# EAGLE design TrakerSłonecznyV3 (EAGLE 9.6.2)
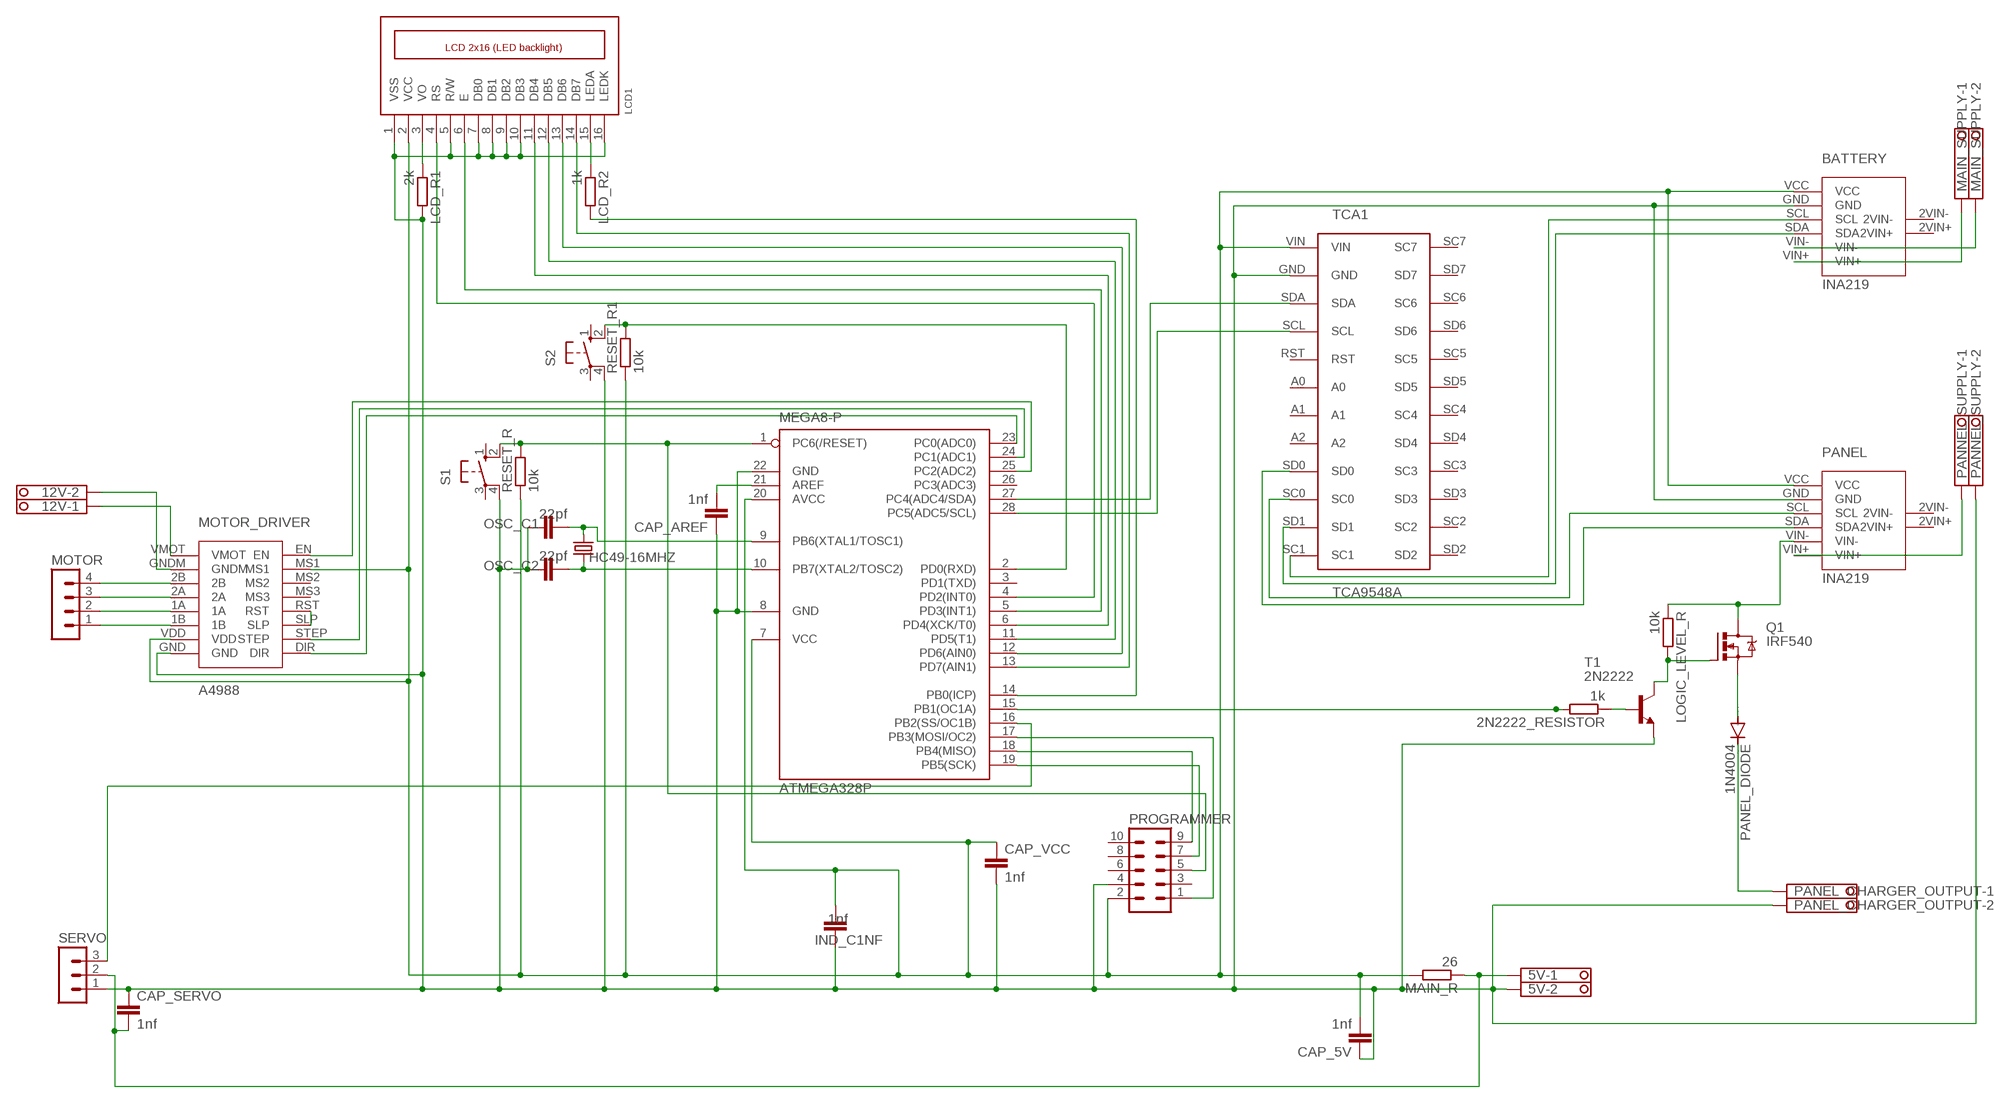
[diagram p0: schematic, sheet 1]

## Parts
2N2222_RESISTOR  1k  R-EU_0207/2V  [0207/2V]
5V  TERMINAL-BLOCK-3.5MM-2-PIN-ROUND-PAD  [TERMINAL-BLOCK-2-PIN-3.5MM-ROUND-PAD]
12V  TERMINAL-BLOCK-3.5MM-2-PIN-ROUND-PAD  [TERMINAL-BLOCK-2-PIN-3.5MM-ROUND-PAD]
ATMEGA328P  MEGA8-P  [DIL28-3]
BATTERY  INA219  [INA219]
CAP_5V  1nf  C-EU025-024X044  [C025-024X044]
CAP_AREF  1nf  C-EU025-024X044  [C025-024X044]
CAP_SERVO  1nf  C-EU025-024X044  [C025-024X044]
CAP_VCC  1nf  C-EU025-024X044  [C025-024X044]
HC49-16MHZ  CRYTALHC49S  [HC49/S]
IND_C1NF  1nf  C-EU025-024X044  [C025-024X044]
LCD1  LCD_2X16_SIL  [HY-1602F]
LCD_R1  2k  R-EU_0207/2V  [0207/2V]
LCD_R2  1k  R-EU_0207/2V  [0207/2V]
LOGIC_LEVEL_R  10k  R-EU_0207/2V  [0207/2V]
MAIN_R  26  R-EU_0207/2V  [0207/2V]
MAIN_SUPPLY  TERMINAL-BLOCK-3.5MM-2-PIN-ROUND-PAD  [TERMINAL-BLOCK-2-PIN-3.5MM-ROUND-PAD]
MOTOR  MA04-1  [MA04-1]
MOTOR_DRIVER  A4988  [A4988]
OSC_C1  22pf  C-EU025-024X044  [C025-024X044]
OSC_C2  22pf  C-EU025-024X044  [C025-024X044]
PANEL  INA219  [INA219]
PANEL_CHARGER_OUTPUT  TERMINAL-BLOCK-3.5MM-2-PIN-ROUND-PAD  [TERMINAL-BLOCK-2-PIN-3.5MM-ROUND-PAD]
PANEL_DIODE  1N4004  [DO41-10]
PANNEL_SUPPLY  TERMINAL-BLOCK-3.5MM-2-PIN-ROUND-PAD  [TERMINAL-BLOCK-2-PIN-3.5MM-ROUND-PAD]
PROGRAMMER  MA05-2  [MA05-2]
Q1  IRF540  [TO220BV]
RESET_R  10k  R-EU_0207/2V  [0207/2V]
RESET_R1  10k  R-EU_0207/2V  [0207/2V]
S1  10-XX  [B3F-10XX]
S2  10-XX  [B3F-10XX]
SERVO  MA03-1  [MA03-1]
T1  2N2222  [TO92-EBC-OVAL]
TCA1  TCA9548A  [TCA9548A]

## Nets
5V: ATMEGA328P.7(VCC) ATMEGA328P.20(AVCC) BATTERY.VCC CAP_5V.2 CAP_VCC.1 IND_C1NF.2 LCD1.2(VCC) MAIN_R.2 MOTOR_DRIVER.MS1 MOTOR_DRIVER.VDD PANEL.VCC PROGRAMMER.2 RESET_R1.1 RESET_R.1 TCA1.VIN
GND: 5V.2 ATMEGA328P.8(GND) ATMEGA328P.22(GND) BATTERY.GND CAP_5V.1 CAP_AREF.1 CAP_SERVO.1 CAP_VCC.2 IND_C1NF.1 LCD1.1(VSS) LCD1.5(R/W) LCD1.7(DB0) LCD1.8(DB1) LCD1.9(DB2) LCD1.10(DB3) LCD1.16(LEDK) LCD_R1.2 MOTOR_DRIVER.GND OSC_C1.1 OSC_C2.1 PANEL.GND PANEL_CHARGER_OUTPUT.2 PANNEL_SUPPLY.2 PROGRAMMER.4 S1.4(P1) S2.4(P1) SERVO.1 T1.E TCA1.GND
N$1: BATTERY.SCL TCA1.SC1
N$2: ATMEGA328P.9(PB6(XTAL1/TOSC1)) HC49-16MHZ.1 OSC_C1.2
N$3: ATMEGA328P.10(PB7(XTAL2/TOSC2)) HC49-16MHZ.2 OSC_C2.2
N$4: 2N2222_RESISTOR.2 ATMEGA328P.15(PB1(OC1A))
N$5: ATMEGA328P.16(PB2(SS/OC1B)) SERVO.3
N$6: 5V.1 CAP_SERVO.2 MAIN_R.1 SERVO.2
N$7: BATTERY.SDA TCA1.SD1
N$8: ATMEGA328P.6(PD4(XCK/T0)) LCD1.11(DB4)
N$9: MOTOR.1 MOTOR_DRIVER.1B
N$10: MOTOR.2 MOTOR_DRIVER.1A
N$11: ATMEGA328P.11(PD5(T1)) LCD1.12(DB5)
N$12: ATMEGA328P.12(PD6(AIN0)) LCD1.13(DB6)
N$13: ATMEGA328P.13(PD7(AIN1)) LCD1.14(DB7)
N$14: PANEL.SDA TCA1.SD0
N$15: PANEL.SCL TCA1.SC0
N$16: MOTOR.3 MOTOR_DRIVER.2A
N$17: PANEL.VIN+ PANNEL_SUPPLY.1
N$18: ATMEGA328P.4(PD2(INT0)) LCD1.4(RS)
N$19: BATTERY.VIN+ MAIN_SUPPLY.1
N$20: ATMEGA328P.27(PC4(ADC4/SDA)) TCA1.SDA
N$21: ATMEGA328P.28(PC5(ADC5/SCL)) TCA1.SCL
N$22: BATTERY.VIN- MAIN_SUPPLY.2
N$23: LOGIC_LEVEL_R.1 PANEL.VIN- Q1.D
N$24: ATMEGA328P.14(PB0(ICP)) LCD_R2.2
N$25: ATMEGA328P.21(AREF) CAP_AREF.2
N$26: ATMEGA328P.1(PC6(/RESET)) PROGRAMMER.5 RESET_R.2 S1.2(S1)
N$27: MOTOR.4 MOTOR_DRIVER.2B
N$28: LOGIC_LEVEL_R.2 Q1.G T1.C
N$29: 12V.2 MOTOR_DRIVER.GNDM
N$30: 12V.1 MOTOR_DRIVER.VMOT
N$31: MOTOR_DRIVER.RST MOTOR_DRIVER.SLP
N$32: ATMEGA328P.23(PC0(ADC0)) MOTOR_DRIVER.DIR
N$33: ATMEGA328P.24(PC1(ADC1)) MOTOR_DRIVER.STEP
N$34: ATMEGA328P.25(PC2(ADC2)) MOTOR_DRIVER.EN
N$35: 2N2222_RESISTOR.1 T1.B
N$36: ATMEGA328P.2(PD0(RXD)) RESET_R1.2 S2.2(S1)
N$38: PANEL_CHARGER_OUTPUT.1 PANEL_DIODE.C
N$39: PANEL_DIODE.A Q1.S
N$40: LCD1.15(LEDA) LCD_R2.1
N$41: ATMEGA328P.17(PB3(MOSI/OC2)) PROGRAMMER.1
N$43: ATMEGA328P.19(PB5(SCK)) PROGRAMMER.7
N$44: ATMEGA328P.18(PB4(MISO)) PROGRAMMER.9
N$45: ATMEGA328P.5(PD3(INT1)) LCD1.6(E)
N$47: LCD1.3(VO) LCD_R1.1
Unconnected: ATMEGA328P.3(PD1(TXD)) ATMEGA328P.26(PC3(ADC3)) BATTERY.2VIN+ BATTERY.2VIN- MOTOR_DRIVER.MS2 MOTOR_DRIVER.MS3 PANEL.2VIN+ PANEL.2VIN- PROGRAMMER.3 PROGRAMMER.6 PROGRAMMER.8 PROGRAMMER.10 S1.1(S) S1.3(P) S2.1(S) S2.3(P) TCA1.A0 TCA1.A1 TCA1.A2 TCA1.RST TCA1.SC2 TCA1.SC3 TCA1.SC4 TCA1.SC5 TCA1.SC6 TCA1.SC7 TCA1.SD2 TCA1.SD3 TCA1.SD4 TCA1.SD5 TCA1.SD6 TCA1.SD7

## Library data of the parts
2N2222_RESISTOR LCD_R1 LCD_R2 LOGIC_LEVEL_R MAIN_R RESET_R RESET_R1 = rcl:R-EU_: RESISTOR, European symbol; SPICEPREFIX: R
5V 12V MAIN_SUPPLY PANEL_CHARGER_OUTPUT PANNEL_SUPPLY = Rembrandt Electronics - Terminal Block 3-5mm v1-0:TERMINAL-BLOCK-3.5MM-2-PIN: Terminal Block 3.5mm Pitch: 3,5 mm Number of pins: 2 Created by Rembrandt Electronics www.rembrandtelectronics.com
ATMEGA328P = atmel:MEGA8-P: MICROCONTROLLER 8 Kbytes FLASH, 1 kbytes SRAM, 512 bytes EEPROM, USART, 4-channel 10 bit ADC, 2-channel 8 bit ADC Pin compatible with Atmega48, ATMega88, ATMega168 Source: avr.lbr; OC_FARNELL: unknown; OC_NEWARK: unknown
BATTERY PANEL = TrackerSłonecznyLIB:INA219
CAP_5V CAP_AREF CAP_SERVO CAP_VCC IND_C1NF OSC_C1 OSC_C2 = rcl:C-EU: CAPACITOR, European symbol; SPICEPREFIX: C
HC49-16MHZ = crystal:CRYTAL: CRYSTAL
LCD1 = lcd_2x16_led_backlight:LCD_2X16_SIL
MOTOR = con-lstb:MA04-1: PIN HEADER; OC_FARNELL: unknown; OC_NEWARK: unknown
MOTOR_DRIVER = TrackerSłonecznyLIB:A4988
PANEL_DIODE = diode:1N4004: DIODE general purpose rectifier, 1 A
PROGRAMMER = con-lstb:MA05-2: PIN HEADER; OC_FARNELL: unknown; OC_NEWARK: unknown
Q1 = transistor-power:IRF540: HEXFET Power MOSFET
S1 S2 = switch-omron:10-XX: OMRON SWITCH; MPN: B3F-1000; OC_FARNELL: 176432; OC_NEWARK: 36M3542
SERVO = con-lstb:MA03-1: PIN HEADER; OC_FARNELL: unknown; OC_NEWARK: unknown
T1 = adafruit:2N2222: NPN TRANSISTOR Big oval pads
TCA1 = TrackerSłonecznyLIB:TCA9548A

## Board
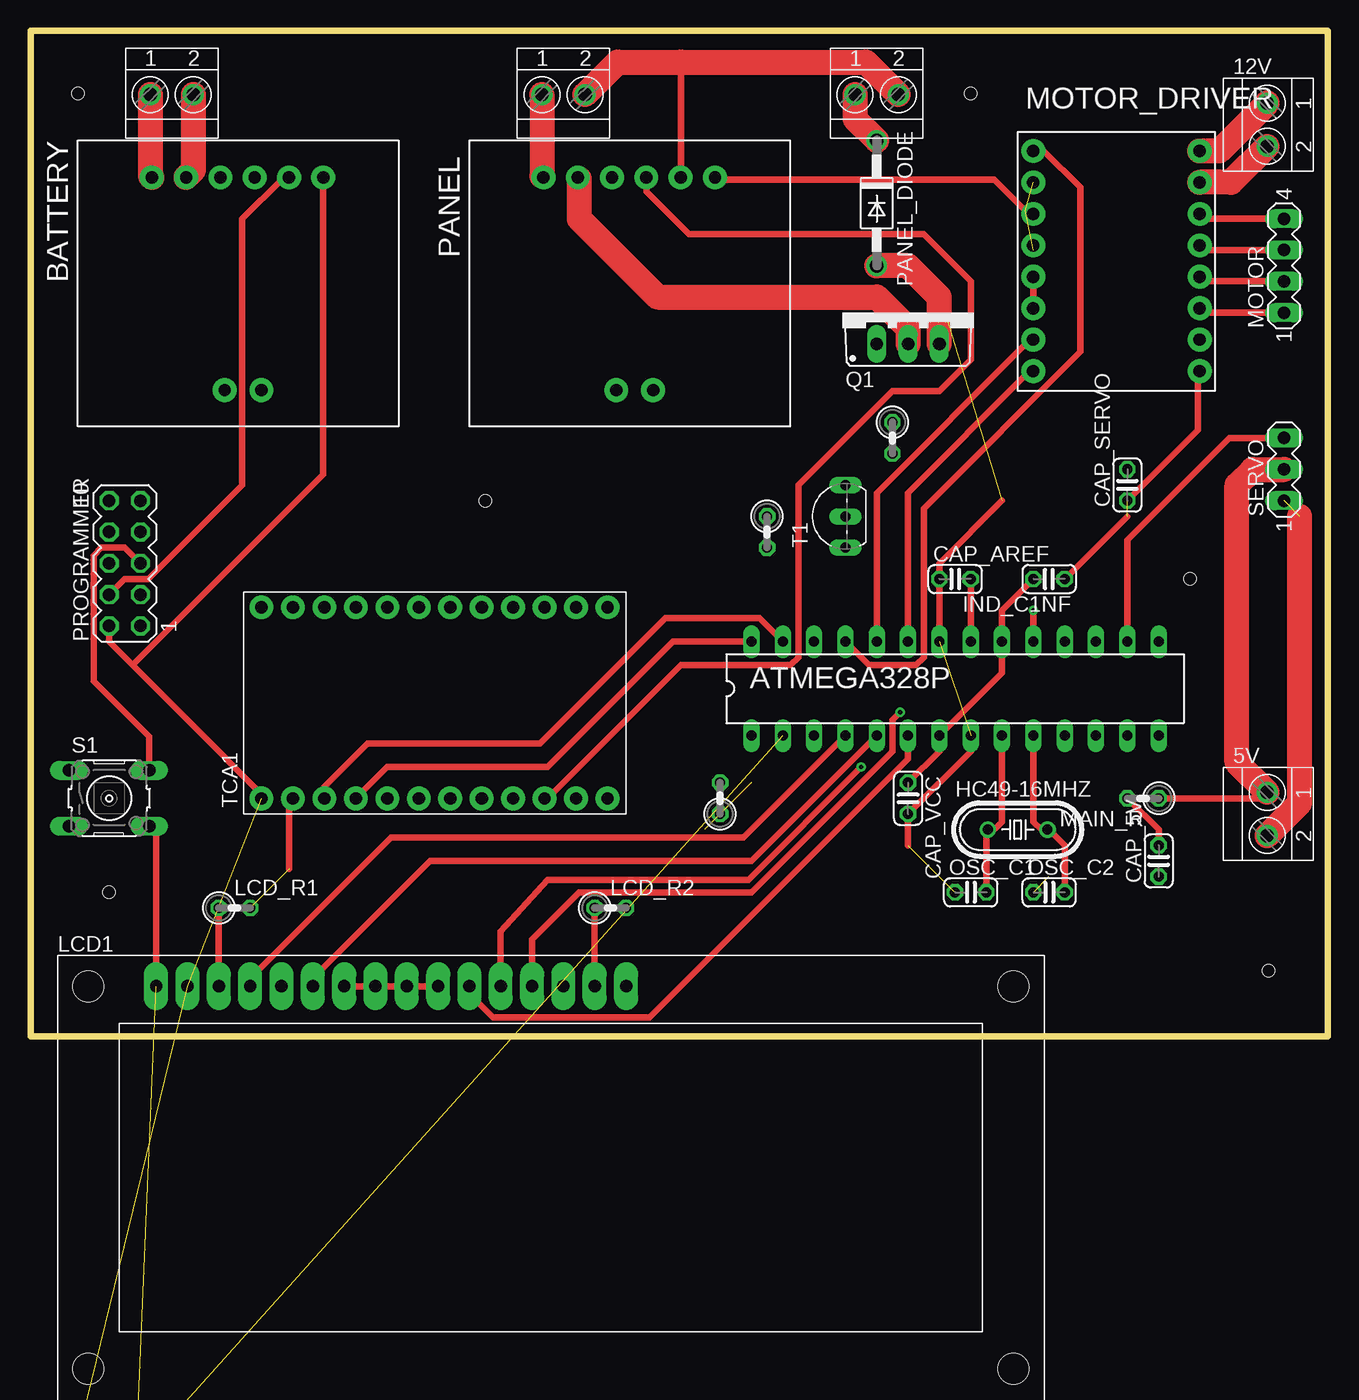
[diagram p1: board, top side]
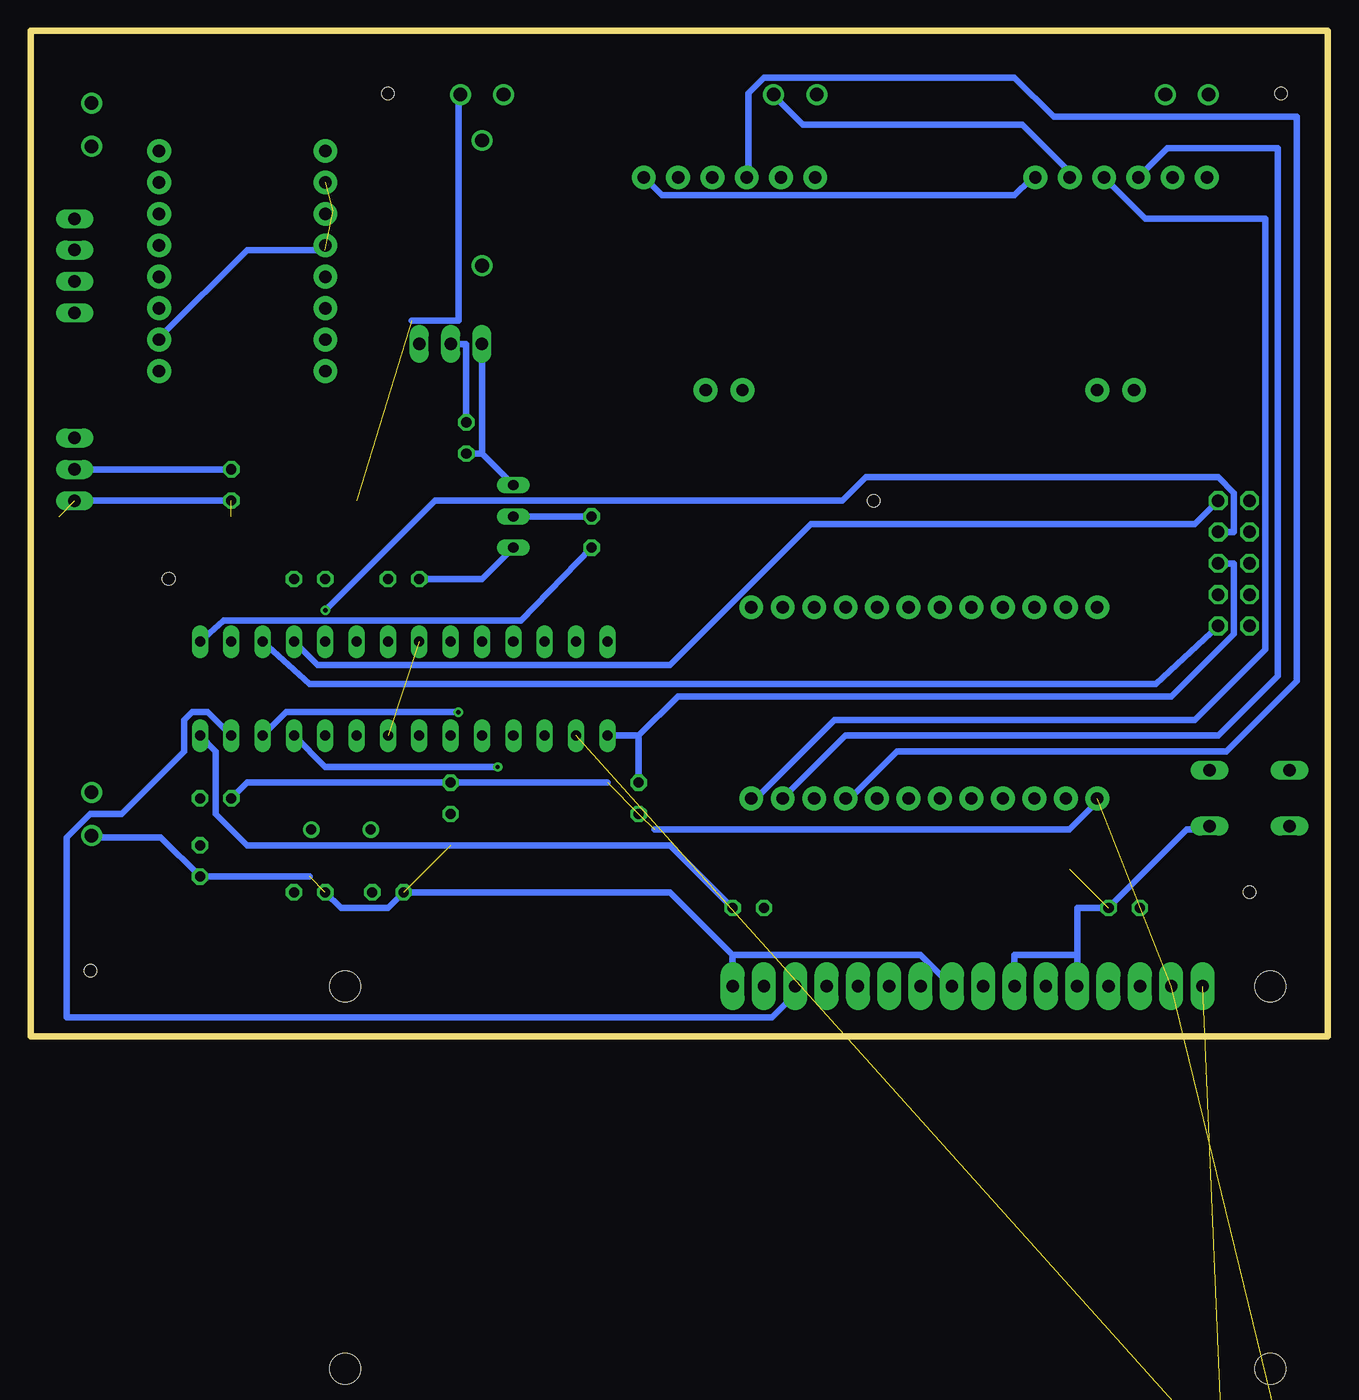
[diagram p2: board, bottom side, seen from below]

Size 105.16 x 81.52 mm. Coordinates in mm from the lower left corner, seen from the top.
Outline: 0,0 105.16,0 105.16,81.52 0,81.52 0,0
Copper layers (1*16): Top 0.035mm / dielectric 1.5mm / Bottom 0.035mm
Design rules "default": minimum track width 6mil, minimum drill 0.35mm, track to track 6mil, track to pad 6mil, pad to pad 6mil, via to via 6mil, smd to smd 6mil, copper to edge 40mil, drill to drill 6mil, minimum pad ring 10mil, minimum via ring 8mil, stop-mask expansion 4mil, vias tented up to drill 0mil, thermal gap 10mil
Holes 1 mm at 3.81,76.45 36.83,43.43 76.2,76.45 93.98,37.08 100.33,5.33 6.35,11.68

### Footprints (pad centres in the part's own frame; a part is rotated, then mirrored left to right if it is on the bottom)
0207/2V = drill 0.813 octagon: 1 -1.27,0; 2 1.27,0
TERMINAL-BLOCK-2-PIN-3.5MM-ROUND-PAD = drill 1.1 pad 1.7: 1 -1.75,-0.1; 2 1.75,-0.1
DIL28-3 = drill 0.813 long: 1 -16.51,-3.81; 2 -13.97,-3.81; 3 -11.43,-3.81; 4 -8.89,-3.81; 5 -6.35,-3.81; 6 -3.81,-3.81; 7 -1.27,-3.81; 8 1.27,-3.81; 9 3.81,-3.81; 10 6.35,-3.81; 11 8.89,-3.81; 12 11.43,-3.81; 13 13.97,-3.81; 14 16.51,-3.81; 15 16.51,3.81; 16 13.97,3.81; 17 11.43,3.81; 18 8.89,3.81; 19 6.35,3.81; 20 3.81,3.81; 21 1.27,3.81; 22 -1.27,3.81; 23 -3.81,3.81; 24 -6.35,3.81; 25 -8.89,3.81; 26 -11.43,3.81; 27 -13.97,3.81; 28 -16.51,3.81
INA219 = drill 1 pad 1.93: 2VIN+ 20.25,11.9; 2VIN- 20.25,14.89; GND 3,17.12; SCL 3,14.34; SDA 3,11.56; VCC 3,19.9; VIN+ 3,6; VIN- 3,8.78
C025-024X044 = drill 0.813 octagon: 1 -1.27,0; 2 1.27,0
HC49/S = drill 0.813: 1 -2.413,0; 2 2.413,0
HY-1602F = drill 1 pad 1.93 long: 1 2.54,0; 2 5.08,0; 3 7.62,0; 4 10.16,0; 5 12.7,0; 6 15.24,0; 7 17.78,0; 8 20.32,0; 9 22.86,0; 10 25.4,0; 11 27.94,0; 12 30.48,0; 13 33.02,0; 14 35.56,0; 15 38.1,0; 16 40.64,0 | hole 2.5: -2.96,0; 72.04,0; -2.96,-31; 72.04,-31
MA04-1 = drill 1.016 long: 1 -3.81,0; 2 -1.27,0; 3 1.27,0; 4 3.81,0
A4988 = drill 1 pad 1.93: 1A 14.75,9.26; 1B 14.75,6.71; 2A 14.75,11.81; 2B 14.75,14.36; DIR 1.26,1.61; EN 1.26,19.46; GND 14.75,1.61; GNDM 14.75,16.91; MS1 1.26,16.91; MS2 1.26,14.36; MS3 1.26,11.81; RST 1.26,9.26; SLP 1.26,6.71; STEP 1.26,4.16; VDD 14.75,4.16; VMOT 14.75,19.46
DO41-10 = drill 1.118: A 5.08,0; C -5.08,0
MA05-2 = drill 1.016 octagon: 1 -5.08,-1.27; 2 -5.08,1.27; 3 -2.54,-1.27; 4 -2.54,1.27; 5 0,-1.27; 6 0,1.27; 7 2.54,-1.27; 8 2.54,1.27; 9 5.08,-1.27; 10 5.08,1.27
TO220BV = drill 1.016 long: D 0,-2.54; G -2.54,-2.54; S 2.54,-2.54
B3F-10XX = drill 1.016 long: 1 -3.251,2.261; 2 3.251,2.261; 3 -3.251,-2.261; 4 3.251,-2.261
MA03-1 = drill 1.016 long: 1 -2.54,0; 2 0,0; 3 2.54,0
TO92-EBC-OVAL = drill 0.813 long: B 0,-1.27; C 2.54,-1.27; E -2.54,-1.27
TCA9548A = drill 1 pad 1.93: A0 1.26,16.81; A1 1.26,14.26; A2 1.26,11.71; GND 1.26,27.01; RST 1.26,19.36; SC0 1.26,6.61; SC1 1.26,1.51; SC2 16.76,4.06; SC3 16.76,9.16; SC4 16.76,14.26; SC5 16.76,19.36; SC6 16.76,24.46; SC7 16.76,29.56; SCL 1.26,21.91; SD0 1.26,9.16; SD1 1.26,4.06; SD2 16.76,1.51; SD3 16.76,6.61; SD4 16.76,11.71; SD5 16.76,16.81; SD6 16.76,21.91; SD7 16.76,27.01; SDA 1.26,24.46; VIN 1.26,29.56

### Placement (x,y rotation side)
2N2222_RESISTOR  59.69,40.89 270 top
5V  100.33,18.03 270 top
12V  100.33,73.91 270 top
ATMEGA328P  74.93,28.19 0 top
BATTERY  3.81,72.64 270 top
CAP_5V  91.44,14.22 90 top
CAP_AREF  74.93,37.08 0 top
CAP_SERVO  88.9,44.7 90 top
CAP_VCC  71.12,19.3 270 top
HC49-16MHZ  80.01,16.76 0 top
IND_C1NF  82.55,37.08 180 top
LCD1  7.62,4.06 0 top
LCD_R1  16.51,10.41 0 top
LCD_R2  46.99,10.41 0 top
LOGIC_LEVEL_R  69.85,48.51 270 top
MAIN_R  90.17,19.3 180 top
MAIN_SUPPLY  11.43,76.45 0 top
MOTOR  101.6,62.48 90 top
MOTOR_DRIVER  80.01,52.32 0 top
OSC_C1  76.2,11.68 0 top
OSC_C2  82.55,11.68 0 top
PANEL  35.56,72.64 270 top
PANEL_CHARGER_OUTPUT  68.58,76.45 0 top
PANEL_DIODE  68.58,67.56 270 top
PANNEL_SUPPLY  43.18,76.45 0 top
PROGRAMMER  7.62,38.35 90 top
Q1  71.12,58.67 0 top
RESET_R  55.88,19.3 90 top
RESET_R1  2.54,-42.93 0 top  (outside the outline)
S1  6.35,19.3 0 top
S2  5.08,-36.58 0 top  (outside the outline)
SERVO  101.6,45.97 90 top
T1  64.77,42.16 90 top
TCA1  48.26,18.03 90 top

### Tracks (layer width: path | path; a pad name or v marks a point on that pad's centre or on a via)
5V  (6 unrouted)
  Top 0.508: 80.64,66.93 78.11,69.47 55.88,69.47 PANEL.VCC | CAP_5V.2 91.44,16.76 MAIN_R.2 | CAP_VCC.1 73.66,23.11 ATMEGA328P.7 78.74,29.46 ATMEGA328P.20 78.74,34.54 IND_C1NF.2 | PROGRAMMER.2 6.35,32 8.26,30.1 | 8.26,30.1 12.7,25.65 19.05,19.3 TCA1.VIN | BATTERY.VCC 23.71,45.55 8.26,30.1
  Bottom 0.508: 58.42,20.57 CAP_VCC.1 87.63,20.57 MAIN_R.2 | 54.61,16.76 20.95,16.76 19.05,18.67 TCA1.VIN | PANEL.VCC 55.24,69.47 53.98,68.2 25.4,68.2 24.13,69.47 BATTERY.VCC | 81.28,63.75 87.63,63.75 94.61,56.77 MOTOR_DRIVER.VDD
GND  (8 unrouted)
  Top 0.508: PROGRAMMER.4 7.62,37.08 9.53,37.08 17.14,44.7 17.14,66.29 20.32,69.47 BATTERY.GND | 52.7,78.99 52.7,70.1 PANEL.GND | 20.95,13.59 20.95,18.67 TCA1.GND | 71.12,15.49 CAP_VCC.2 76.2,23.11 ATMEGA328P.8 | ATMEGA328P.22 CAP_AREF.1 73.66,38.35 78.74,43.43 | 88.9,42.16 IND_C1NF.1 | LCD1.7 LCD1.8 LCD1.9 LCD1.10 | LCD1.1 10.16,16.76 S1.4 | CAP_SERVO.1 94.61,49.15 94.61,53.59 MOTOR_DRIVER.GND
  Top 2.032: 5V.2 102.87,18.92 102.87,42.16 | PANNEL_SUPPLY.2 47.57,78.99 52.7,78.99 67.69,78.99 PANEL_CHARGER_OUTPUT.2
  Bottom 0.508: BATTERY.GND 20.95,70.1 24.77,73.91 42.55,73.91 44.45,75.82 PANNEL_SUPPLY.2 | T1.E 68.58,37.08 CAP_AREF.1 | 5V.2 99.69,16.13 94.61,16.13 CAP_5V.1 82.55,12.95 | 74.3,58.04 70.48,58.04 70.48,75.82 PANEL_CHARGER_OUTPUT.2 | 48.26,6.6 LCD1.16 | 48.26,6.6 33.02,6.6 LCD1.9 | S1.4 10.16,16.76 11.43,16.76 LCD_R1.2 20.32,10.41 20.32,6.6 | 20.32,6.6 LCD1.5 | LCD1.7 25.4,6.6 20.32,6.6 | OSC_C2.1 80.01,10.41 76.2,10.41 OSC_C1.1 53.34,11.68 48.26,6.6 | SERVO.1 CAP_SERVO.1
N$1
  Bottom 0.508: BATTERY.SCL 14.8,66.29 5.08,66.29 5.08,31.37 10.79,25.65 40.01,25.65 46.35,19.3 TCA1.SC1
N$2
  Top 0.508: OSC_C1.2 77.47,16.76 HC49-16MHZ.1 78.11,16.76 78.74,17.4 ATMEGA328P.9
N$3
  Top 0.508: OSC_C2.2 83.82,15.49 82.55,16.76 HC49-16MHZ.2 81.92,16.76 81.28,17.4 ATMEGA328P.10
N$4
  Bottom 0.508: 2N2222_RESISTOR.2 65.41,33.73 89.53,33.73 ATMEGA328P.15
N$5
  Top 0.508: ATMEGA328P.16 88.9,40.26 97.16,48.51 SERVO.3
N$6
  Top 0.508: MAIN_R.1 99.69,19.3 5V.1
  Top 2.032: 5V.1 97.79,22.22 97.79,44.7 99.06,45.97 SERVO.2
  Bottom 0.508: SERVO.2 CAP_SERVO.2
N$7
  Bottom 0.508: BATTERY.SDA 13.01,72.01 4.06,72.01 4.06,29.21 8.89,24.38 39.11,24.38 TCA1.SD1
N$8
  Top 0.508: ATMEGA328P.6 71.12,22.48 50.16,1.52 37.47,1.52 35.56,3.43 LCD1.11
N$9
  Top 0.508: MOTOR.1 95.25,58.67 MOTOR_DRIVER.1B
N$10
  Top 0.508: MOTOR.2 95.25,61.21 MOTOR_DRIVER.1A
N$11  (via drill 0.35)
  Top 0.508: LCD1.12 38.1,8.51 41.91,12.7 58.17,12.7 v67.31,21.84
  Bottom 0.508: ATMEGA328P.11 81.28,21.84 v67.31,21.84
N$12  (via drill 0.35)
  Top 0.508: v70.48,26.29 69.85,25.65 69.85,23.11 58.42,11.68 44.45,11.68 40.64,7.87 LCD1.13
  Bottom 0.508: ATMEGA328P.12 84.45,26.29 v70.48,26.29
N$13
  Bottom 0.508: ATMEGA328P.13 90.81,26.29 92.08,26.29 92.71,25.65 92.71,23.11 97.79,18.03 100.33,18.03 102.23,16.13 102.23,1.52 45.09,1.52 43.18,3.43 LCD1.14
N$14
  Bottom 0.508: TCA1.SD0 38.73,19.3 34.92,23.11 8.26,23.11 2.54,28.83 2.54,74.55 22.23,74.55 25.4,77.72 45.72,77.72 46.99,76.45 46.99,70.1 PANEL.SDA
N$15
  Top 0.508: PANEL.SCL 49.9,68.46 53.34,65.02 72.39,65.02 76.2,61.21 76.2,54.86 73.66,52.32 69.85,52.32 62.23,44.7 62.23,30.73 61.59,30.1 52.7,30.1 41.91,19.3 TCA1.SC0
N$16
  Top 0.508: MOTOR.3 95.25,63.75 MOTOR_DRIVER.2A
N$17
  Top 0.508: 41.43,69.77 PANEL.VIN+
  Top 2.032: PANNEL_SUPPLY.1 41.43,69.77
N$18
  Top 0.508: ATMEGA328P.4 57.78,16.13 29.21,16.13 17.78,4.7 LCD1.4
N$19
  Top 2.032: MAIN_SUPPLY.1 9.68,69.77 BATTERY.VIN+
N$20
  Top 0.508: ATMEGA328P.27 59.05,33.91 51.44,33.91 41.27,23.75 27.3,23.75 23.8,20.24 TCA1.SDA
N$21
  Top 0.508: ATMEGA328P.28 52.07,32 41.91,21.84 28.9,21.84 TCA1.SCL
N$22
  Top 2.032: MAIN_SUPPLY.2 13.18,70.23 BATTERY.VIN-
N$23
  Top 0.508: PANEL.VIN- 44.45,69.53
  Top 2.032: 44.45,69.53 44.45,66.29 50.8,59.94 68.58,59.94 71.12,57.4 Q1.D
  Bottom 0.508: LOGIC_LEVEL_R.1 69.85,56.13 Q1.D
N$24
  Bottom 0.508: LCD_R2.2 53.34,15.49 87.63,15.49 90.17,18.03 90.17,23.11 ATMEGA328P.14
N$25
  Top 0.508: CAP_AREF.2 ATMEGA328P.21
N$26
  Top 0.508: PROGRAMMER.5 7.62,39.62 5.71,39.62 5.08,38.99 5.08,28.83 9.6,24.31 S1.2
  Bottom 0.508: 55.88,24.38 RESET_R.2 | ATMEGA328P.1 55.88,24.38 | 55.88,24.38 52.7,27.56 12.7,27.56 7.62,32.64 7.62,38.35 PROGRAMMER.5
N$27
  Top 0.508: MOTOR.4 95.25,66.29 MOTOR_DRIVER.2B
N$28
  Bottom 0.508: 68.58,47.24 T1.C | LOGIC_LEVEL_R.2 68.58,47.24 | 68.58,47.24 Q1.G
N$29
  Top 2.032: 12V.2 97.3,69.23 MOTOR_DRIVER.GNDM
N$30
  Top 2.032: 12V.1 96.35,71.78 MOTOR_DRIVER.VMOT
N$31
  Top 0.508: MOTOR_DRIVER.SLP 81.28,59.31 81.28,61.21 MOTOR_DRIVER.RST
N$32
  Top 0.508: ATMEGA328P.23 71.12,44.07 80.64,53.59 MOTOR_DRIVER.DIR
N$33
  Top 0.508: ATMEGA328P.24 68.58,44.07 80.64,56.13 MOTOR_DRIVER.STEP
N$34
  Top 0.508: ATMEGA328P.25 67.94,30.1 71.75,30.1 72.39,30.73 72.39,42.8 85.09,55.5 85.09,68.83 82.14,71.78 MOTOR_DRIVER.EN
N$35
  Bottom 0.508: 2N2222_RESISTOR.1 T1.B
N$36  (2 unrouted)
N$38
  Top 2.032: PANEL_CHARGER_OUTPUT.1 66.83,74.39 PANEL_DIODE.C
N$39
  Top 2.032: Q1.S 73.66,59.94 71.12,62.48 PANEL_DIODE.A
N$40
  Top 0.508: LCD1.15 LCD_R2.1
N$41
  Bottom 0.508: ATMEGA328P.17 82.55,28.58 13.97,28.58 PROGRAMMER.1
N$43  (via drill 0.35)
  Top 0.508: v81.28,34.54 ATMEGA328P.19
  Bottom 0.508: v81.28,34.54 72.39,43.43 39.37,43.43 37.47,45.34 8.89,45.34 7.62,44.07 7.62,40.89 PROGRAMMER.7
N$44
  Bottom 0.508: ATMEGA328P.18 81.92,30.1 53.34,30.1 41.91,41.53 10.79,41.53 PROGRAMMER.9
N$45
  Top 0.508: LCD1.6 22.86,4.7 32.38,14.22 58.42,14.22 ATMEGA328P.5
N$47
  Top 0.508: LCD1.3 LCD_R1.1